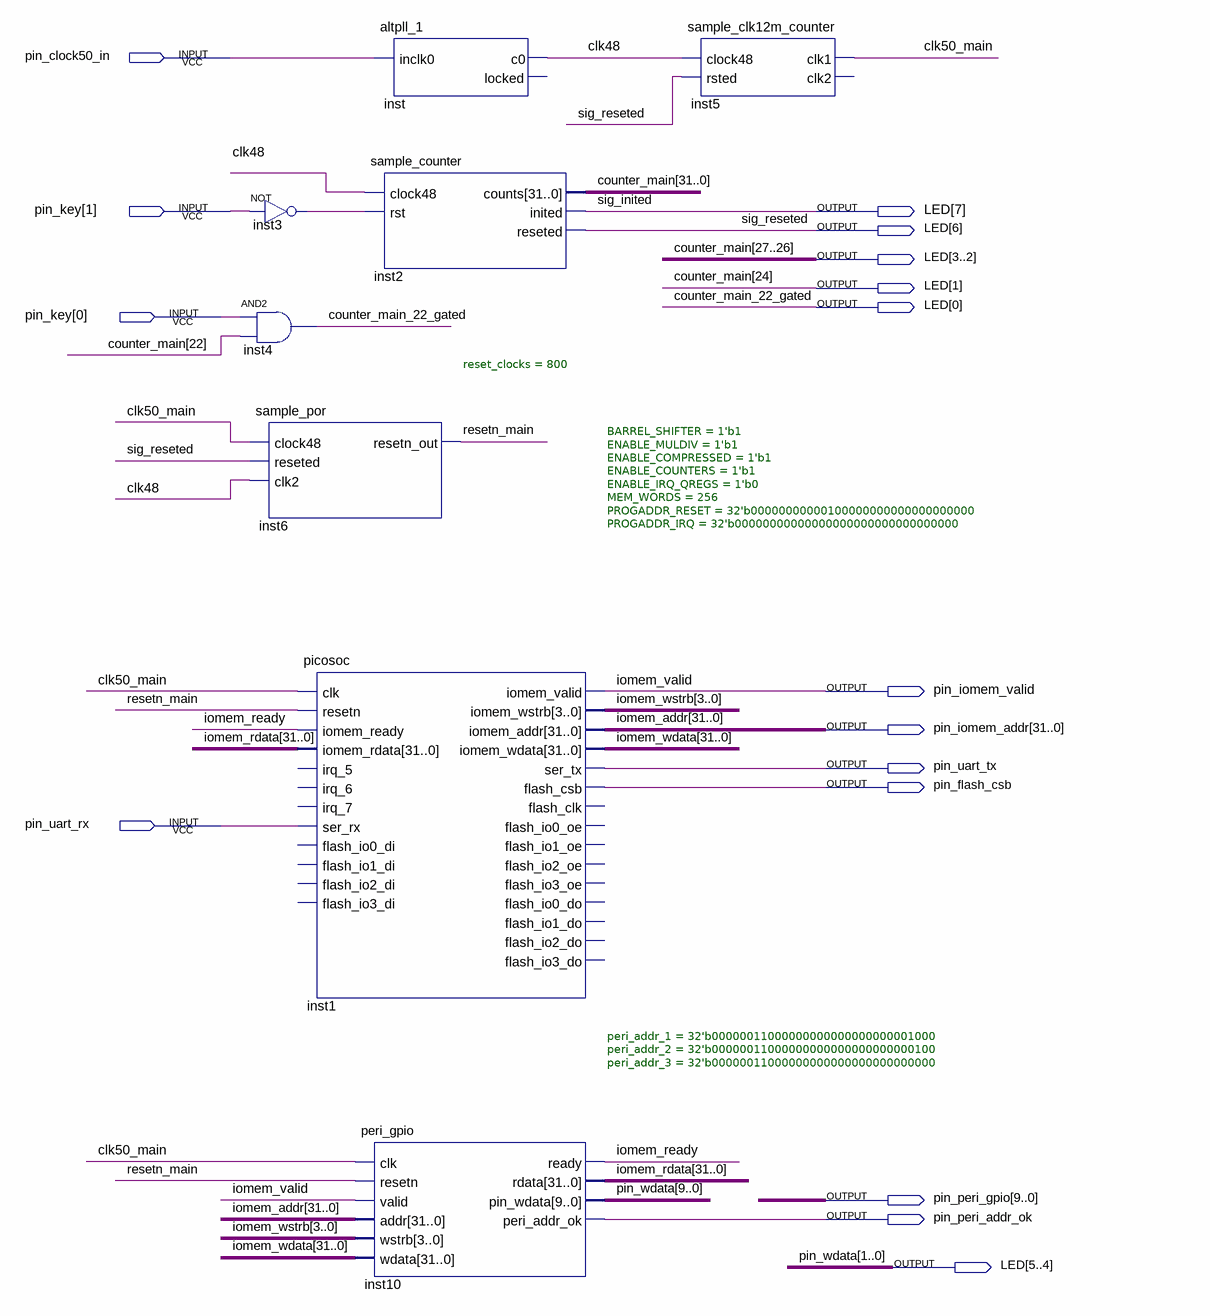
[diagram p0: schematic sheet]
// Quartus schematic nanosoctop.bdf as structural Verilog: 8 symbols, 16 pins
module nanosoctop (
  input  pin_clock50_in,
  input  [1:0] pin_key,
  input  pin_uart_rx,
  output [7:0] LED,
  output pin_iomem_valid,
  output [31:0] pin_iomem_addr,
  output pin_uart_tx,
  output pin_flash_csb,
  output [9:0] pin_peri_gpio,
  output pin_peri_addr_ok
);

  wire clk48, clk50_main, inst3_out, iomem_ready, resetn_main;
  wire [3:0] iomem_wstrb;
  wire [9:2] pin_wdata;
  wire [31:0] counter_main, iomem_rdata, iomem_wdata;

  not inst3 (inst3_out, pin_key[1]);
  and inst4 (LED[0], pin_key[0], counter_main[22]);
  sample_por #(.reset_clocks(800)) inst6 (
    .clock48(clk50_main), .reseted(LED[6]), .clk2(clk48), .resetn_out(resetn_main));
  picosoc #(.BARREL_SHIFTER(1'b1), .ENABLE_MULDIV(1'b1), .ENABLE_COMPRESSED(1'b1), .ENABLE_COUNTERS(1'b1), .ENABLE_IRQ_QREGS(1'b0), .MEM_WORDS(256), .PROGADDR_RESET(32'b00000000000100000000000000000000), .PROGADDR_IRQ(32'b00000000000000000000000000000000)) inst1 (
    .clk(clk50_main), .resetn(resetn_main), .iomem_ready(iomem_ready), .iomem_rdata(iomem_rdata),
    .ser_rx(pin_uart_rx), .iomem_valid(pin_iomem_valid), .iomem_wstrb(iomem_wstrb),
    .iomem_addr(pin_iomem_addr), .iomem_wdata(iomem_wdata), .ser_tx(pin_uart_tx), .flash_csb(pin_flash_csb));  // open: irq_5, irq_6, irq_7, flash_io0_di, flash_io1_di, flash_io2_di, flash_io3_di, flash_clk, flash_io0_oe, flash_io1_oe, flash_io2_oe, flash_io3_oe, flash_io0_do, flash_io1_do, flash_io2_do, flash_io3_do
  altpll_1 inst (.inclk0(pin_clock50_in), .c0(clk48));  // open: locked
  sample_counter inst2 (
    .clock48(clk48), .rst(inst3_out),
    .counts({counter_main[31:28], LED[3:2], counter_main[25], LED[1], counter_main[23:0]}), .inited(LED[7]),
    .reseted(LED[6]));
  peri_gpio #(.peri_addr_1(32'b00000011000000000000000000001000), .peri_addr_2(32'b00000011000000000000000000000100), .peri_addr_3(32'b00000011000000000000000000000000)) inst10 (
    .clk(clk50_main), .resetn(resetn_main), .valid(pin_iomem_valid), .addr(pin_iomem_addr),
    .wstrb(iomem_wstrb), .wdata(iomem_wdata), .ready(iomem_ready), .rdata(iomem_rdata),
    .pin_wdata({pin_wdata, LED[5:4]}), .peri_addr_ok(pin_peri_addr_ok));
  sample_clk12m_counter inst5 (.clock48(clk48), .rsted(LED[6]), .clk1(clk50_main));  // open: clk2

  // Other names for the same wires on the sheet: counter_main (some bits) = LED[3:1]; counter_main_22_gated = LED[0];
  //   iomem_addr[31:0] = pin_iomem_addr; iomem_valid = pin_iomem_valid; pin_wdata[1:0] = LED[5:4];
  //   sig_inited = LED[7]; sig_reseted = LED[6]
endmodule
